# EAGLE schematic AIO (EAGLE 6.4)
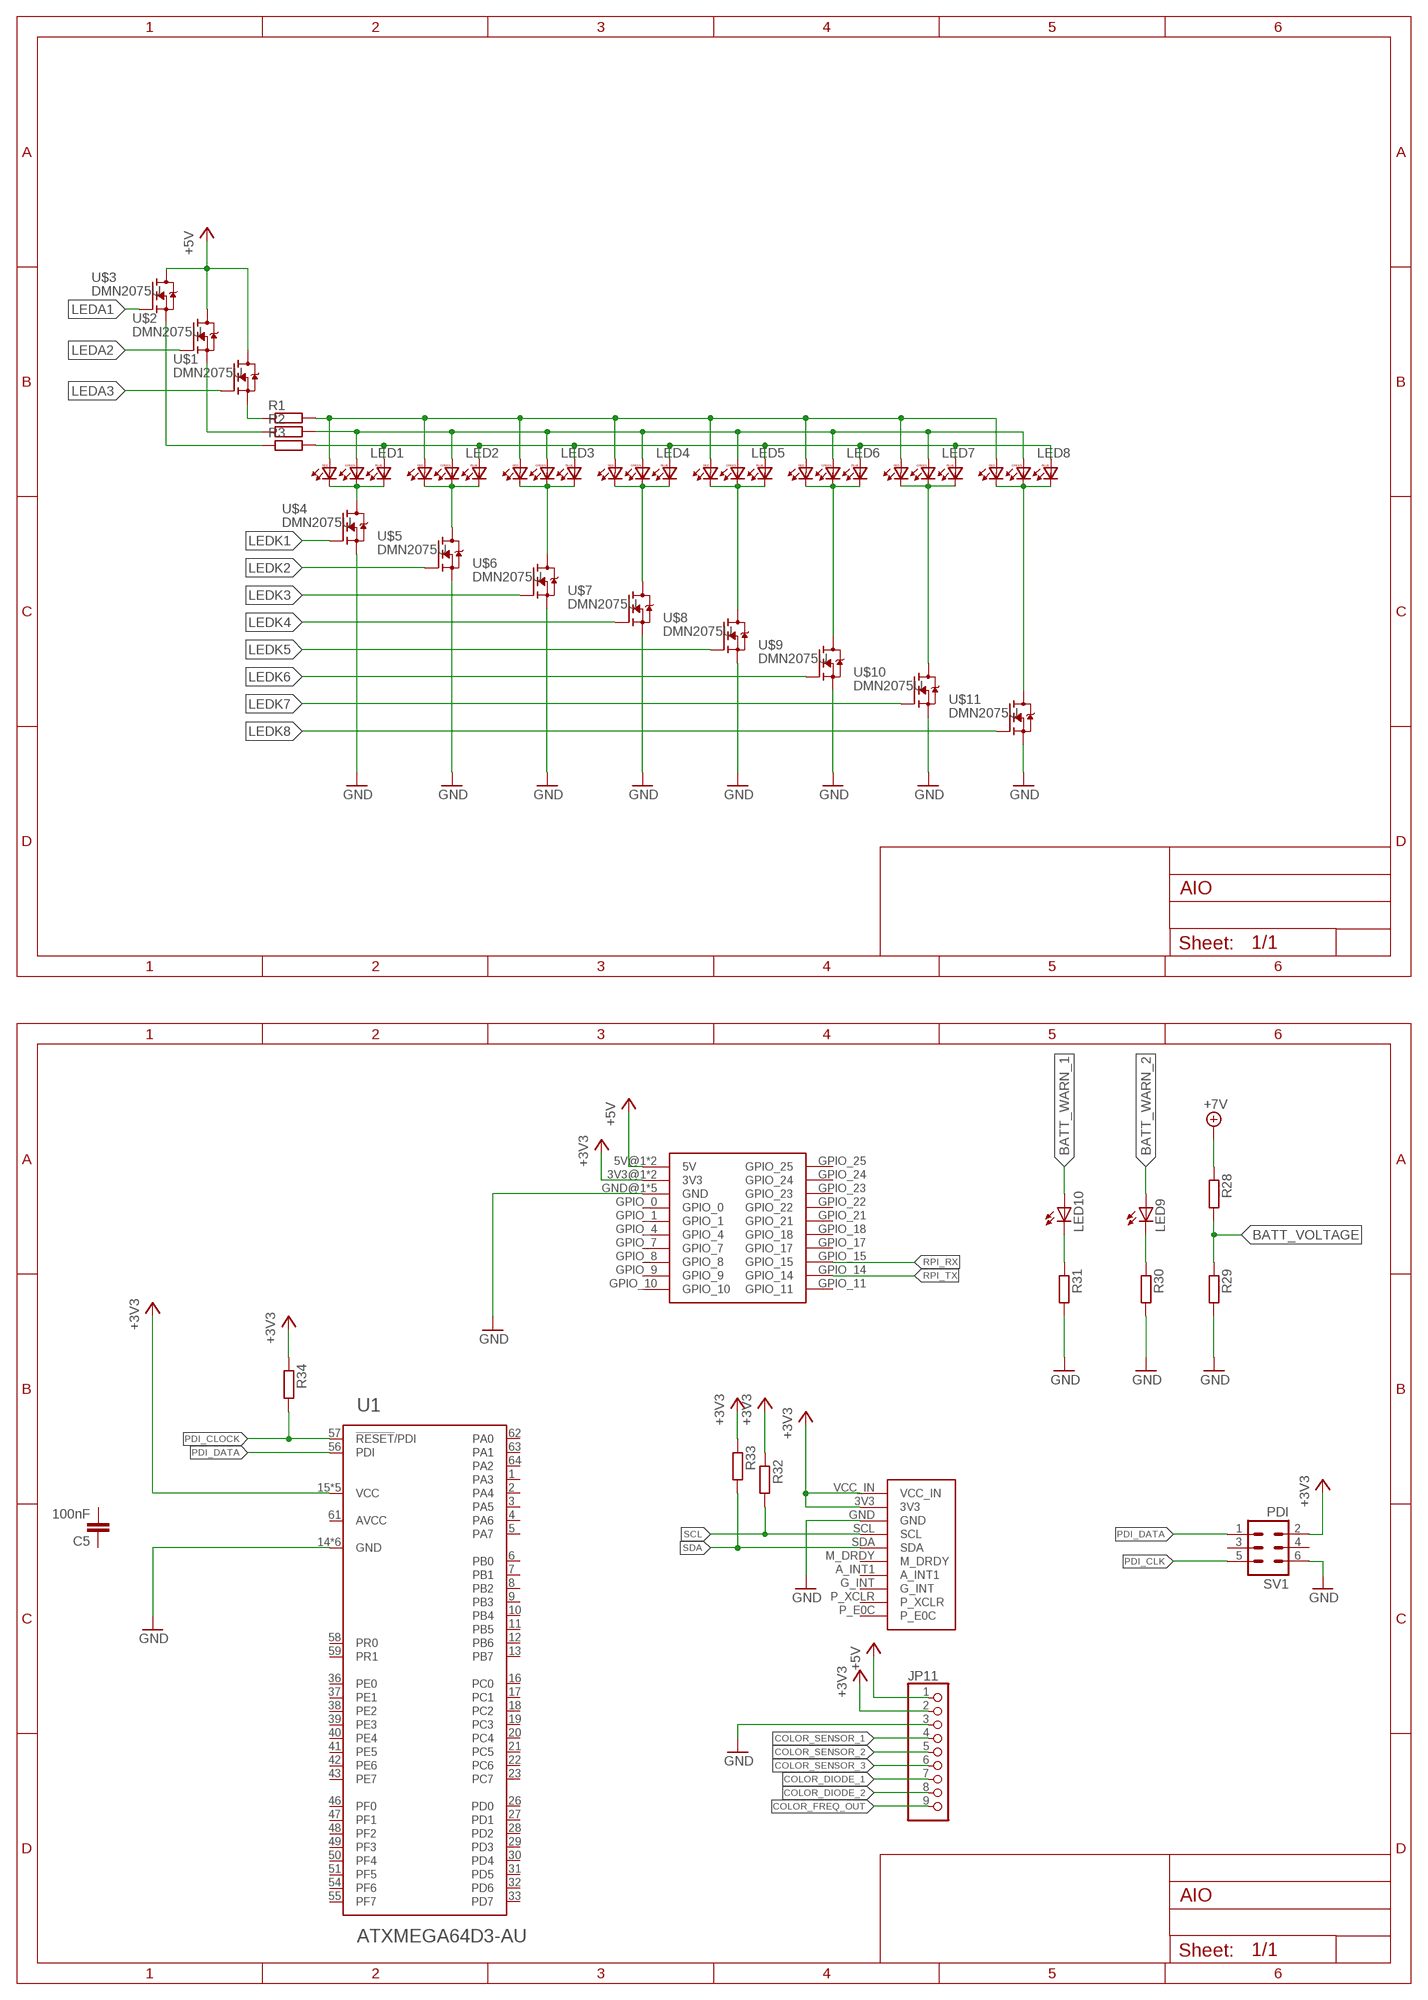
[diagram p0: schematic, sheet 1, part 1 of 2]
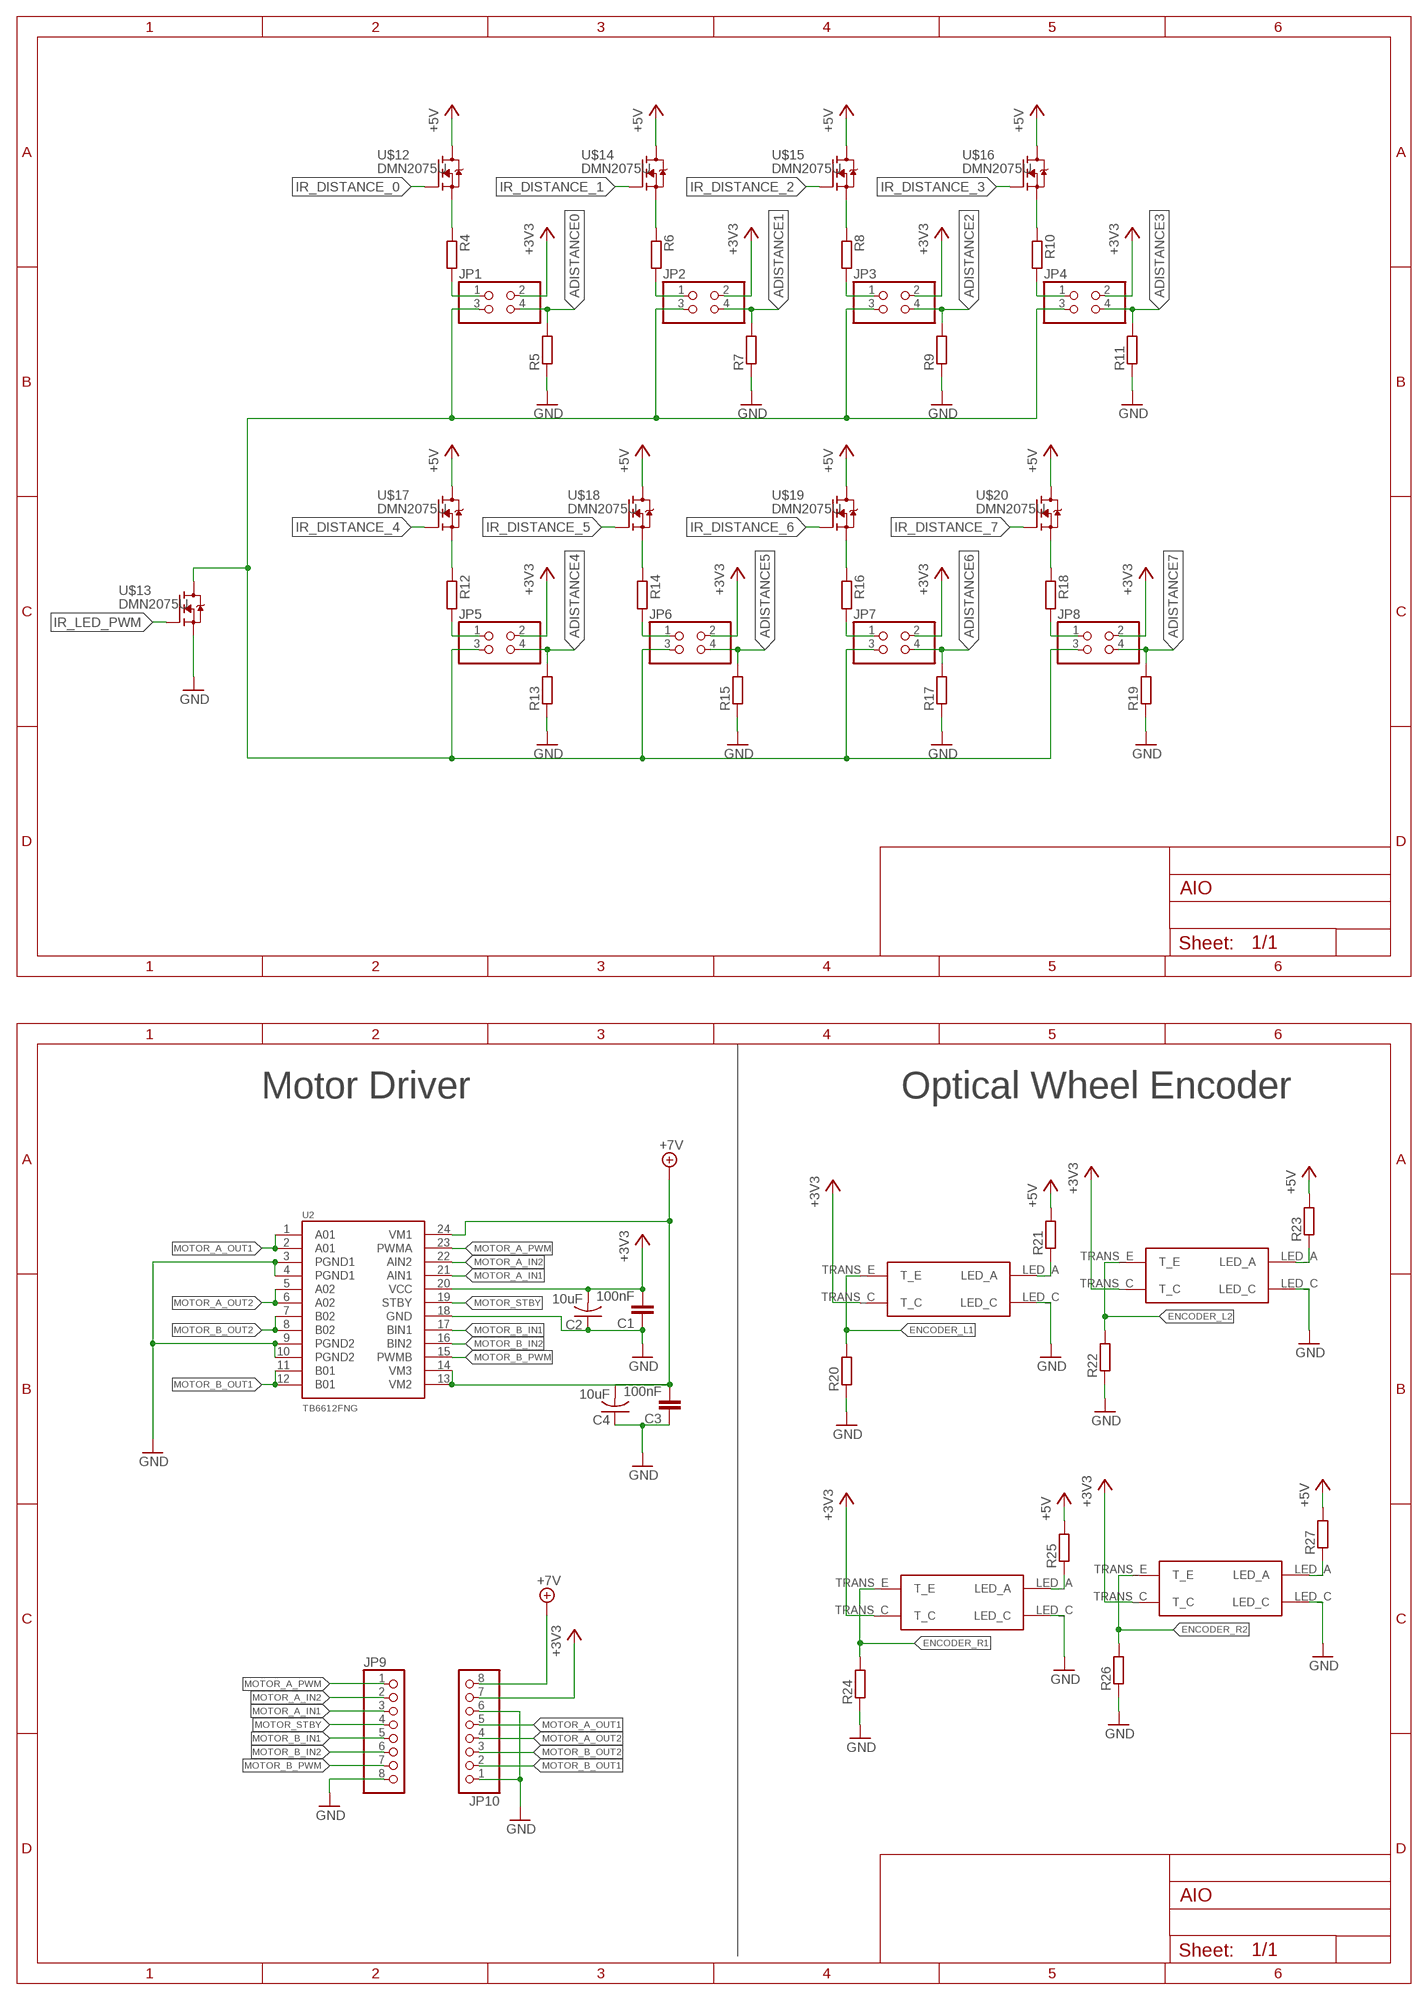
[diagram p1: schematic, sheet 1, part 2 of 2]

## Parts
C1  100nF  C-EUC0402  [C0402]
C2  10uF  C-USC0402  [C0402]
C3  100nF  C-EUC0402  [C0402]
C4  10uF  C-USC0402  [C0402]
C5  100nF  C-EUC0402  [C0402]
JP1  PINHD-2X2/90  [2X02/90]
JP2  PINHD-2X2/90  [2X02/90]
JP3  PINHD-2X2/90  [2X02/90]
JP4  PINHD-2X2/90  [2X02/90]
JP5  PINHD-2X2/90  [2X02/90]
JP6  PINHD-2X2/90  [2X02/90]
JP7  PINHD-2X2/90  [2X02/90]
JP8  PINHD-2X2/90  [2X02/90]
JP9  PINHD-1X8  [1X08]
JP10  PINHD-1X8  [1X08]
JP11  PINHD-1X9  [1X09]
LED1  F503605050  [5050LED]
LED2  F503605050  [5050LED]
LED3  F503605050  [5050LED]
LED4  F503605050  [5050LED]
LED5  F503605050  [5050LED]
LED6  F503605050  [5050LED]
LED7  F503605050  [5050LED]
LED8  F503605050  [5050LED]
LED9  LEDCHIPLED_0603  [CHIPLED_0603]
LED10  LEDCHIPLED_0603  [CHIPLED_0603]
R1  R-EU_R0402  [R0402]
R2  R-EU_R0402  [R0402]
R3  R-EU_R0402  [R0402]
R4  R-EU_R0402  [R0402]
R5  R-EU_R0402  [R0402]
R6  R-EU_R0402  [R0402]
R7  R-EU_R0402  [R0402]
R8  R-EU_R0402  [R0402]
R9  R-EU_R0402  [R0402]
R10  R-EU_R0402  [R0402]
R11  R-EU_R0402  [R0402]
R12  R-EU_R0402  [R0402]
R13  R-EU_R0402  [R0402]
R14  R-EU_R0402  [R0402]
R15  R-EU_R0402  [R0402]
R16  R-EU_R0402  [R0402]
R17  R-EU_R0402  [R0402]
R18  R-EU_R0402  [R0402]
R19  R-EU_R0402  [R0402]
R20  R-EU_R0402  [R0402]
R21  R-EU_R0402  [R0402]
R22  R-EU_R0402  [R0402]
R23  R-EU_R0402  [R0402]
R24  R-EU_R0402  [R0402]
R25  R-EU_R0402  [R0402]
R26  R-EU_R0402  [R0402]
R27  R-EU_R0402  [R0402]
R28  R-EU_R0402  [R0402]
R29  R-EU_R0402  [R0402]
R30  R-EU_R0402  [R0402]
R31  R-EU_R0402  [R0402]
R32  R-EU_R0402  [R0402]
R33  R-EU_R0402  [R0402]
R34  R-EU_R0402  [R0402]
SV1  PDI  ML6  [ML6]
U1  ATXMEGA64D3-AU  [TQFP-64A-64]
U2  TB6612FNG  TB6621FNG  [SSOP24]
U$1  DMN2075U  [SOT95P240X112-3N]
U$2  DMN2075U  [SOT95P240X112-3N]
U$3  DMN2075U  [SOT95P240X112-3N]
U$4  DMN2075U  [SOT95P240X112-3N]
U$5  DMN2075U  [SOT95P240X112-3N]
U$6  DMN2075U  [SOT95P240X112-3N]
U$7  DMN2075U  [SOT95P240X112-3N]
U$8  DMN2075U  [SOT95P240X112-3N]
U$9  DMN2075U  [SOT95P240X112-3N]
U$10  DMN2075U  [SOT95P240X112-3N]
U$11  DMN2075U  [SOT95P240X112-3N]
U$12  DMN2075U  [SOT95P240X112-3N]
U$13  DMN2075U  [SOT95P240X112-3N]
U$14  DMN2075U  [SOT95P240X112-3N]
U$15  DMN2075U  [SOT95P240X112-3N]
U$16  DMN2075U  [SOT95P240X112-3N]
U$17  DMN2075U  [SOT95P240X112-3N]
U$18  DMN2075U  [SOT95P240X112-3N]
U$19  DMN2075U  [SOT95P240X112-3N]
U$20  DMN2075U  [SOT95P240X112-3N]
U$21  CNY70  [CNY70]
U$22  CNY70  [CNY70]
U$23  CNY70  [CNY70]
U$24  CNY70  [CNY70]
U$25  GY-81  [GY-81]
U$26  RASPBERRY-PI  [RASPERRRY-PI]

## Nets
+3V3: C1.2 C2.2 JP1.2 JP2.2 JP3.2 JP4.2 JP5.2 JP6.2 JP7.2 JP8.2 JP10.7 JP11.2 R32.1 R33.1 R34.1 SV1.2 U1.15(VCC) U1.25(VCC) U1.35(VCC) U1.45(VCC) U1.53(VCC) U2.20(VCC) U$21.TRANS_C(T_C) U$22.TRANS_C(T_C) U$23.TRANS_C(T_C) U$24.TRANS_C(T_C) U$25.3V3 U$25.VCC_IN U$26.3V3@1(3V3) U$26.3V3@2(3V3)
+5V: JP11.1 R21.2 R23.2 R25.2 R27.2 U$1.D U$2.D U$3.D U$12.D U$14.D U$15.D U$16.D U$17.D U$18.D U$19.D U$20.D U$26.5V@1(5V) U$26.5V@2(5V)
+7V: C3.2 C4.2 JP10.8 R28.1 U2.13(VM2) U2.14(VM3) U2.24(VM1)
ADISTANCE0: JP1.4 R5.2
ADISTANCE1: JP2.4 R7.2
ADISTANCE2: JP3.4 R9.2
ADISTANCE3: JP4.4 R11.2
ADISTANCE4: JP5.4 R13.2
ADISTANCE5: JP6.4 R15.2
ADISTANCE6: JP7.4 R17.2
ADISTANCE7: JP8.4 R19.2
BATT_VOLTAGE: R28.2 R29.1
BATT_WARN_1: LED10.A
BATT_WARN_2: LED9.A
COLOR_DIODE_1: JP11.7
COLOR_DIODE_2: JP11.8
COLOR_FREQ_OUT: JP11.9
COLOR_SENSOR_1: JP11.4
COLOR_SENSOR_2: JP11.5
COLOR_SENSOR_3: JP11.6
ENCODER_L1: R20.2 U$21.TRANS_E(T_E)
ENCODER_L2: R22.2 U$22.TRANS_E(T_E)
ENCODER_R1: R24.2 U$23.TRANS_E(T_E)
ENCODER_R2: R26.2 U$24.TRANS_E(T_E)
GND: C1.1 C2.1 C3.1 C4.1 JP9.8 JP10.1 JP10.6 JP11.3 R5.1 R7.1 R9.1 R11.1 R13.1 R15.1 R17.1 R19.1 R20.1 R22.1 R24.1 R26.1 R29.2 R30.2 R31.2 SV1.6 U1.14(GND) U1.24(GND) U1.34(GND) U1.44(GND) U1.52(GND) U1.60(GND) U2.3(PGND1) U2.4(PGND1) U2.9(PGND2) U2.10(PGND2) U2.18(GND) U$4.S U$5.S U$6.S U$7.S U$8.S U$9.S U$10.S U$11.S U$13.S U$21.LED_C U$22.LED_C U$23.LED_C U$24.LED_C U$25.GND U$26.GND@1(GND) U$26.GND@2(GND) U$26.GND@3(GND) U$26.GND@4(GND) U$26.GND@5(GND)
IR_DISTANCE_0: U$12.G
IR_DISTANCE_1: U$14.G
IR_DISTANCE_2: U$15.G
IR_DISTANCE_3: U$16.G
IR_DISTANCE_4: U$17.G
IR_DISTANCE_5: U$18.G
IR_DISTANCE_6: U$19.G
IR_DISTANCE_7: U$20.G
IR_LED_PWM: U$13.G
LEDA1: U$3.G
LEDA2: U$2.G
LEDA3: U$1.G
LEDK1: U$4.G
LEDK2: U$5.G
LEDK3: U$6.G
LEDK4: U$7.G
LEDK5: U$8.G
LEDK6: U$9.G
LEDK7: U$10.G
LEDK8: U$11.G
MOTOR_A_IN1: JP9.3 U2.21(AIN1)
MOTOR_A_IN2: JP9.2 U2.22(AIN2)
MOTOR_A_OUT1: JP10.5 U2.1(A01) U2.2(A01)
MOTOR_A_OUT2: JP10.4 U2.5(A02) U2.6(A02)
MOTOR_A_PWM: JP9.1 U2.23(PWMA)
MOTOR_B_IN1: JP9.5 U2.17(BIN1)
MOTOR_B_IN2: JP9.6 U2.16(BIN2)
MOTOR_B_OUT1: JP10.2 U2.11(B01) U2.12(B01)
MOTOR_B_OUT2: JP10.3 U2.7(B02) U2.8(B02)
MOTOR_B_PWM: JP9.7 U2.15(PWMB)
MOTOR_STBY: JP9.4 U2.19(STBY)
N$1: R1.1 U$1.S
N$2: R2.1 U$2.S
N$3: R3.1 U$3.S
N$4: LED2.B2(BC) LED2.G2(GC) LED2.R2(RC) U$5.D
N$5: JP1.1 R4.2
N$6: LED1.B2(BC) LED1.G2(GC) LED1.R2(RC) U$4.D
N$7: LED3.B2(BC) LED3.G2(GC) LED3.R2(RC) U$6.D
N$8: R4.1 U$12.S
N$9: JP2.1 R6.2
N$10: LED4.B2(BC) LED4.G2(GC) LED4.R2(RC) U$7.D
N$11: R23.1 U$22.LED_A
N$12: R6.1 U$14.S
N$13: JP1.3 JP2.3 JP3.3 JP4.3 JP5.3 JP6.3 JP7.3 JP8.3 U$13.D
N$14: LED5.B2(BC) LED5.G2(GC) LED5.R2(RC) U$8.D
N$15: LED6.B2(BC) LED6.G2(GC) LED6.R2(RC) U$9.D
N$16: LED7.B2(BC) LED7.G2(GC) LED7.R2(RC) U$10.D
N$17: LED8.B2(BC) LED8.G2(GC) LED8.R2(RC) U$11.D
N$18: JP3.1 R8.2
N$19: R8.1 U$15.S
N$20: R25.1 U$23.LED_A
N$21: JP4.1 R10.2
N$22: R10.1 U$16.S
N$23: R21.1 U$21.LED_A
N$24: JP5.1 R12.2
N$25: R12.1 U$17.S
N$26: R27.1 U$24.LED_A
N$27: JP6.1 R14.2
N$28: R14.1 U$18.S
N$29: LED9.C R30.1
N$30: JP7.1 R16.2
N$31: R16.1 U$19.S
N$32: LED10.C R31.1
N$33: LED1.R1(RA) LED2.R1(RA) LED3.R1(RA) LED4.R1(RA) LED5.R1(RA) LED6.R1(RA) LED7.R1(RA) LED8.R1(RA) R1.2
N$34: LED1.G1(GA) LED2.G1(GA) LED3.G1(GA) LED4.G1(GA) LED5.G1(GA) LED6.G1(GA) LED7.G1(GA) LED8.G1(GA) R2.2
N$35: LED1.B1(BA) LED2.B1(BA) LED3.B1(BA) LED4.B1(BA) LED5.B1(BA) LED6.B1(BA) LED7.B1(BA) LED8.B1(BA) R3.2
N$36: JP8.1 R18.2
N$37: R18.1 U$20.S
PDI_CLK: SV1.5
PDI_CLOCK: R34.2 U1.57(!RESET!/PDI)
PDI_DATA: SV1.1 U1.56(PDI)
RPI_RX: U$26.GPIO_15
RPI_TX: U$26.GPIO_14
SCL: R32.2 U$25.SCL
SDA: R33.2 U$25.SDA
Unconnected: C5.1 C5.2 SV1.3 SV1.4 U1.1(PA3) U1.2(PA4) U1.3(PA5) U1.4(PA6) U1.5(PA7) U1.6(PB0) U1.7(PB1) U1.8(PB2) U1.9(PB3) U1.10(PB4) U1.11(PB5) U1.12(PB6) U1.13(PB7) U1.16(PC0) U1.17(PC1) U1.18(PC2) U1.19(PC3) U1.20(PC4) U1.21(PC5) U1.22(PC6) U1.23(PC7) U1.26(PD0) U1.27(PD1) U1.28(PD2) U1.29(PD3) U1.30(PD4) U1.31(PD5) U1.32(PD6) U1.33(PD7) U1.36(PE0) U1.37(PE1) U1.38(PE2) U1.39(PE3) U1.40(PE4) U1.41(PE5) U1.42(PE6) U1.43(PE7) U1.46(PF0) U1.47(PF1) U1.48(PF2) U1.49(PF3) U1.50(PF4) U1.51(PF5) U1.54(PF6) U1.55(PF7) U1.58(PR0) U1.59(PR1) U1.62(PA0) U1.63(PA1) U1.64(PA2) U$25.A_INT1 U$25.G_INT U$25.M_DRDY U$25.P_E0C U$25.P_XCLR U$26.GPIO_0 U$26.GPIO_1 U$26.GPIO_4 U$26.GPIO_7 U$26.GPIO_8 U$26.GPIO_9 U$26.GPIO_10 U$26.GPIO_11 U$26.GPIO_17 U$26.GPIO_18 U$26.GPIO_21 U$26.GPIO_22 U$26.GPIO_23 U$26.GPIO_24 U$26.GPIO_25

## Notes on the sheet
- Motor Driver | Optical Wheel Encoder

## Power pins joined to a net without a drawn wire
AVCC: U1.61(AVCC)

## Library data of the parts
C1 C3 C5 = rcl:C-EU: CAPACITOR, European symbol
C2 C4 = rcl:C-US: CAPACITOR, American symbol
JP1-JP8 = pinhead:PINHD-2X2: PIN HEADER
JP9 JP10 = pinhead:PINHD-1X8: PIN HEADER
JP11 = pinhead:PINHD-1X9: PIN HEADER
LED1-LED8 = BEEP:F50360: Full color Z-Power LED RGB P5-II Series Source: http://www.seoulsemicon.co.kr .. F50360.pdf
LED9 LED10 = led:LED: LED OSRAM: - CHIPLED LG R971, LG N971, LY N971, LG Q971, LY Q971, LO R971, LY R971 LH N974, LH R974 LS Q976, LO Q976, LY Q976 LO Q996 - Hyper CHIPLED LW Q18S LB Q993, LB Q99A, LB R99A - SideLED LS A670, LO A670, LY A670, LG A670, LP A670 LB A673, LV A673, LT A673, LW A673 LH A674 LY A675 LS A676, LA A676, LO A676, LY A676, LW A676 LS A679, LY A679, LG A679 - Hyper Micro SIDELED® LS Y876, LA Y876, LO Y876, LY Y876 LT Y87S - SmartLED LW L88C, LW L88S LB L89C, LB L89S, LG L890 LS L89K, LO L89K, LY L89K LS L896, LA L896, LO L896, LY L896 - TOPLED LS T670, LO T670, LY T670, LG T670, LP T670 LSG T670, LSP T670, LSY T670, LOP T670, LYG T670 LG T671, LOG T671, LSG T671 LB T673, LV T673, LT T673, LW T673 LH T674 LS T676, LA T676, LO T676, LY T676, LB T676, LH T676, LSB T676, LW T676 LB T67C, LV T67C, LT T67C, LS T67K, LO T67K, LY T67K, LW E67C LS E67B, LA E67B, LO E67B, LY E67B, LB E67C, LV E67C, LT E67C LW T67C LS T679, LY T679, LG T679 LS T770, LO T770, LY T770, LG T770, LP T770 LB T773, LV T773, LT T773, LW T773 LH T774 LS E675, LA E675, LY E675, LS T675 LS T776, LA T776, LO T776, LY T776, LB T776 LHGB T686 LT T68C, LB T68C - Hyper Mini TOPLED® LB M676 - Mini TOPLED Santana® LG M470 LS M47K, LO M47K, LY M47K Source: http://www.osram.convergy.de LUXEON: - LUMILED® LXK2-PW12-R00, LXK2-PW12-S00, LXK2-PW14-U00, LXK2-PW14-V00 LXK2-PM12-R00, LXK2-PM12-S00, LXK2-PM14-U00 LXK2-PE12-Q00, LXK2-PE12-R00, LXK2-PE12-S00, LXK2-PE14-T00, LXK2-PE14-U00 LXK2-PB12-K00, LXK2-PB12-L00, LXK2-PB12-M00, LXK2-PB14-N00, LXK2-PB14-P00, LXK2-PB14-Q00 LXK2-PR12-L00, LXK2-PR12-M00, LXK2-PR14-Q00, LXK2-PR14-R00 LXK2-PD12-Q00, LXK2-PD12-R00, LXK2-PD12-S00 LXK2-PH12-R00, LXK2-PH12-S00 LXK2-PL12-P00, LXK2-PL12-Q00, LXK2-PL12-R00 Source: www.luxeon.com KINGBRIGHT: KA-3528ASYC Source: www.kingbright.com
R1-R34 = rcl:R-EU_: RESISTOR, European symbol
SV1 = con-ml:ML6: HARTING; OC_FARNELL: unknown; OC_NEWARK: unknown
U1 = atmel-xmega:ATXMEGA64D3: 8/16-bit XMEGA C3 Microcontroller Features High-performance, Low-power 8/16-bit Atmel® AVR® XMEGATM Microcontroller Non-volatile Program and Data Memories – 64K - 256K Bytes of In-System Self-Programmable Flash – 4K - 8K Bytes Boot Code Section with Independent Lock Bits – 2K - 4K Bytes EEPROM – 4K - 16K Bytes Internal SRAM Peripheral Features – Four-channel Event System – Five 16-bit Timer/Counters Four Timer/Counters with 4 Output Compare or Input Capture channels One Timer/Counters with 2 Output Compare or Input Capture channels High Resolution Extensions on two Timer/Counters Advanced Waveform Extension on one Timer/Counter – Three USARTs IrDA Extension on 1 USART – Two Two-Wire Interfaces with dual address match(I2C and SMBus compatible) – Two SPI (Serial Peripheral Interfaces) – 16-bit Real Time Counter with Separate Oscillator – One Sixteen-channel, 12-bit, 200ksps Analog to Digital Converter – Two Analog Comparators with Window compare function – External Interrupts on all General Purpose I/O pins – Programmable Watchdog Timer with Separate On-chip Ultra Low Power Oscillator Special Microcontroller Features – Power-on Reset and Programmable Brown-out Detection – Internal and External Clock Options with PLL – Programmable Multi-level Interrupt Controller – Sleep Modes: Idle, Power-down, Standby, Power-save, Extended Standby – Advanced Programming, Test and Debugging Interface PDI (Program and Debug Interface) for programming, test and debugging I/O and Packages – 50 Programmable I/O Lines – 64-lead TQFP – 64-pad QFN Operating Voltage – 1.6 – 3.6V Speed performance – 0 – 12 MHz @ 1.6 – 3.6V – 0 – 32 MHz @ 2.7 – 3.6V
U2 = SparkFun-PowerIC:TB6621FNG: Toshiba 1A dual motor driver IC-09363; PROD_ID: IC-09363
U$1-U$20 = BEEP:DMN2075U
U$21-U$24 = BEEP:CNY70
U$25 = BEEP:GY-81
U$26 = BEEP:RASPBERRY-PI